# Altium schematic sheet 17.RK3588_HDMI_eDP Interface.SchDoc
size 420 x 297 mm; Revision: V2.1; Schematic Page Number: 11; Page Number: 17; Check: <Checker>; Schematic Name: RK_NVR_DEMO1_RK3588_LP4/4x_V21; Page Count: 43; Page name: 17.RK3588_HDMI/eDP Interface; Designer: Zhangdz; Schematic Page Count: 99; Revcode: V2.1; DsnPath: E:\Work\SBER\RK3588_SOM\temp\RK_NVR_DEMO1_RK3588_LP4XD200P232SD8_V21_20211228.DSN; SchematicName: RK_NVR_DEMO1_RK3588_LP4/4x_V21; PageName: 17.RK3588_HDMI/eDP Interface; PageSize: A3; TopSchematic: True
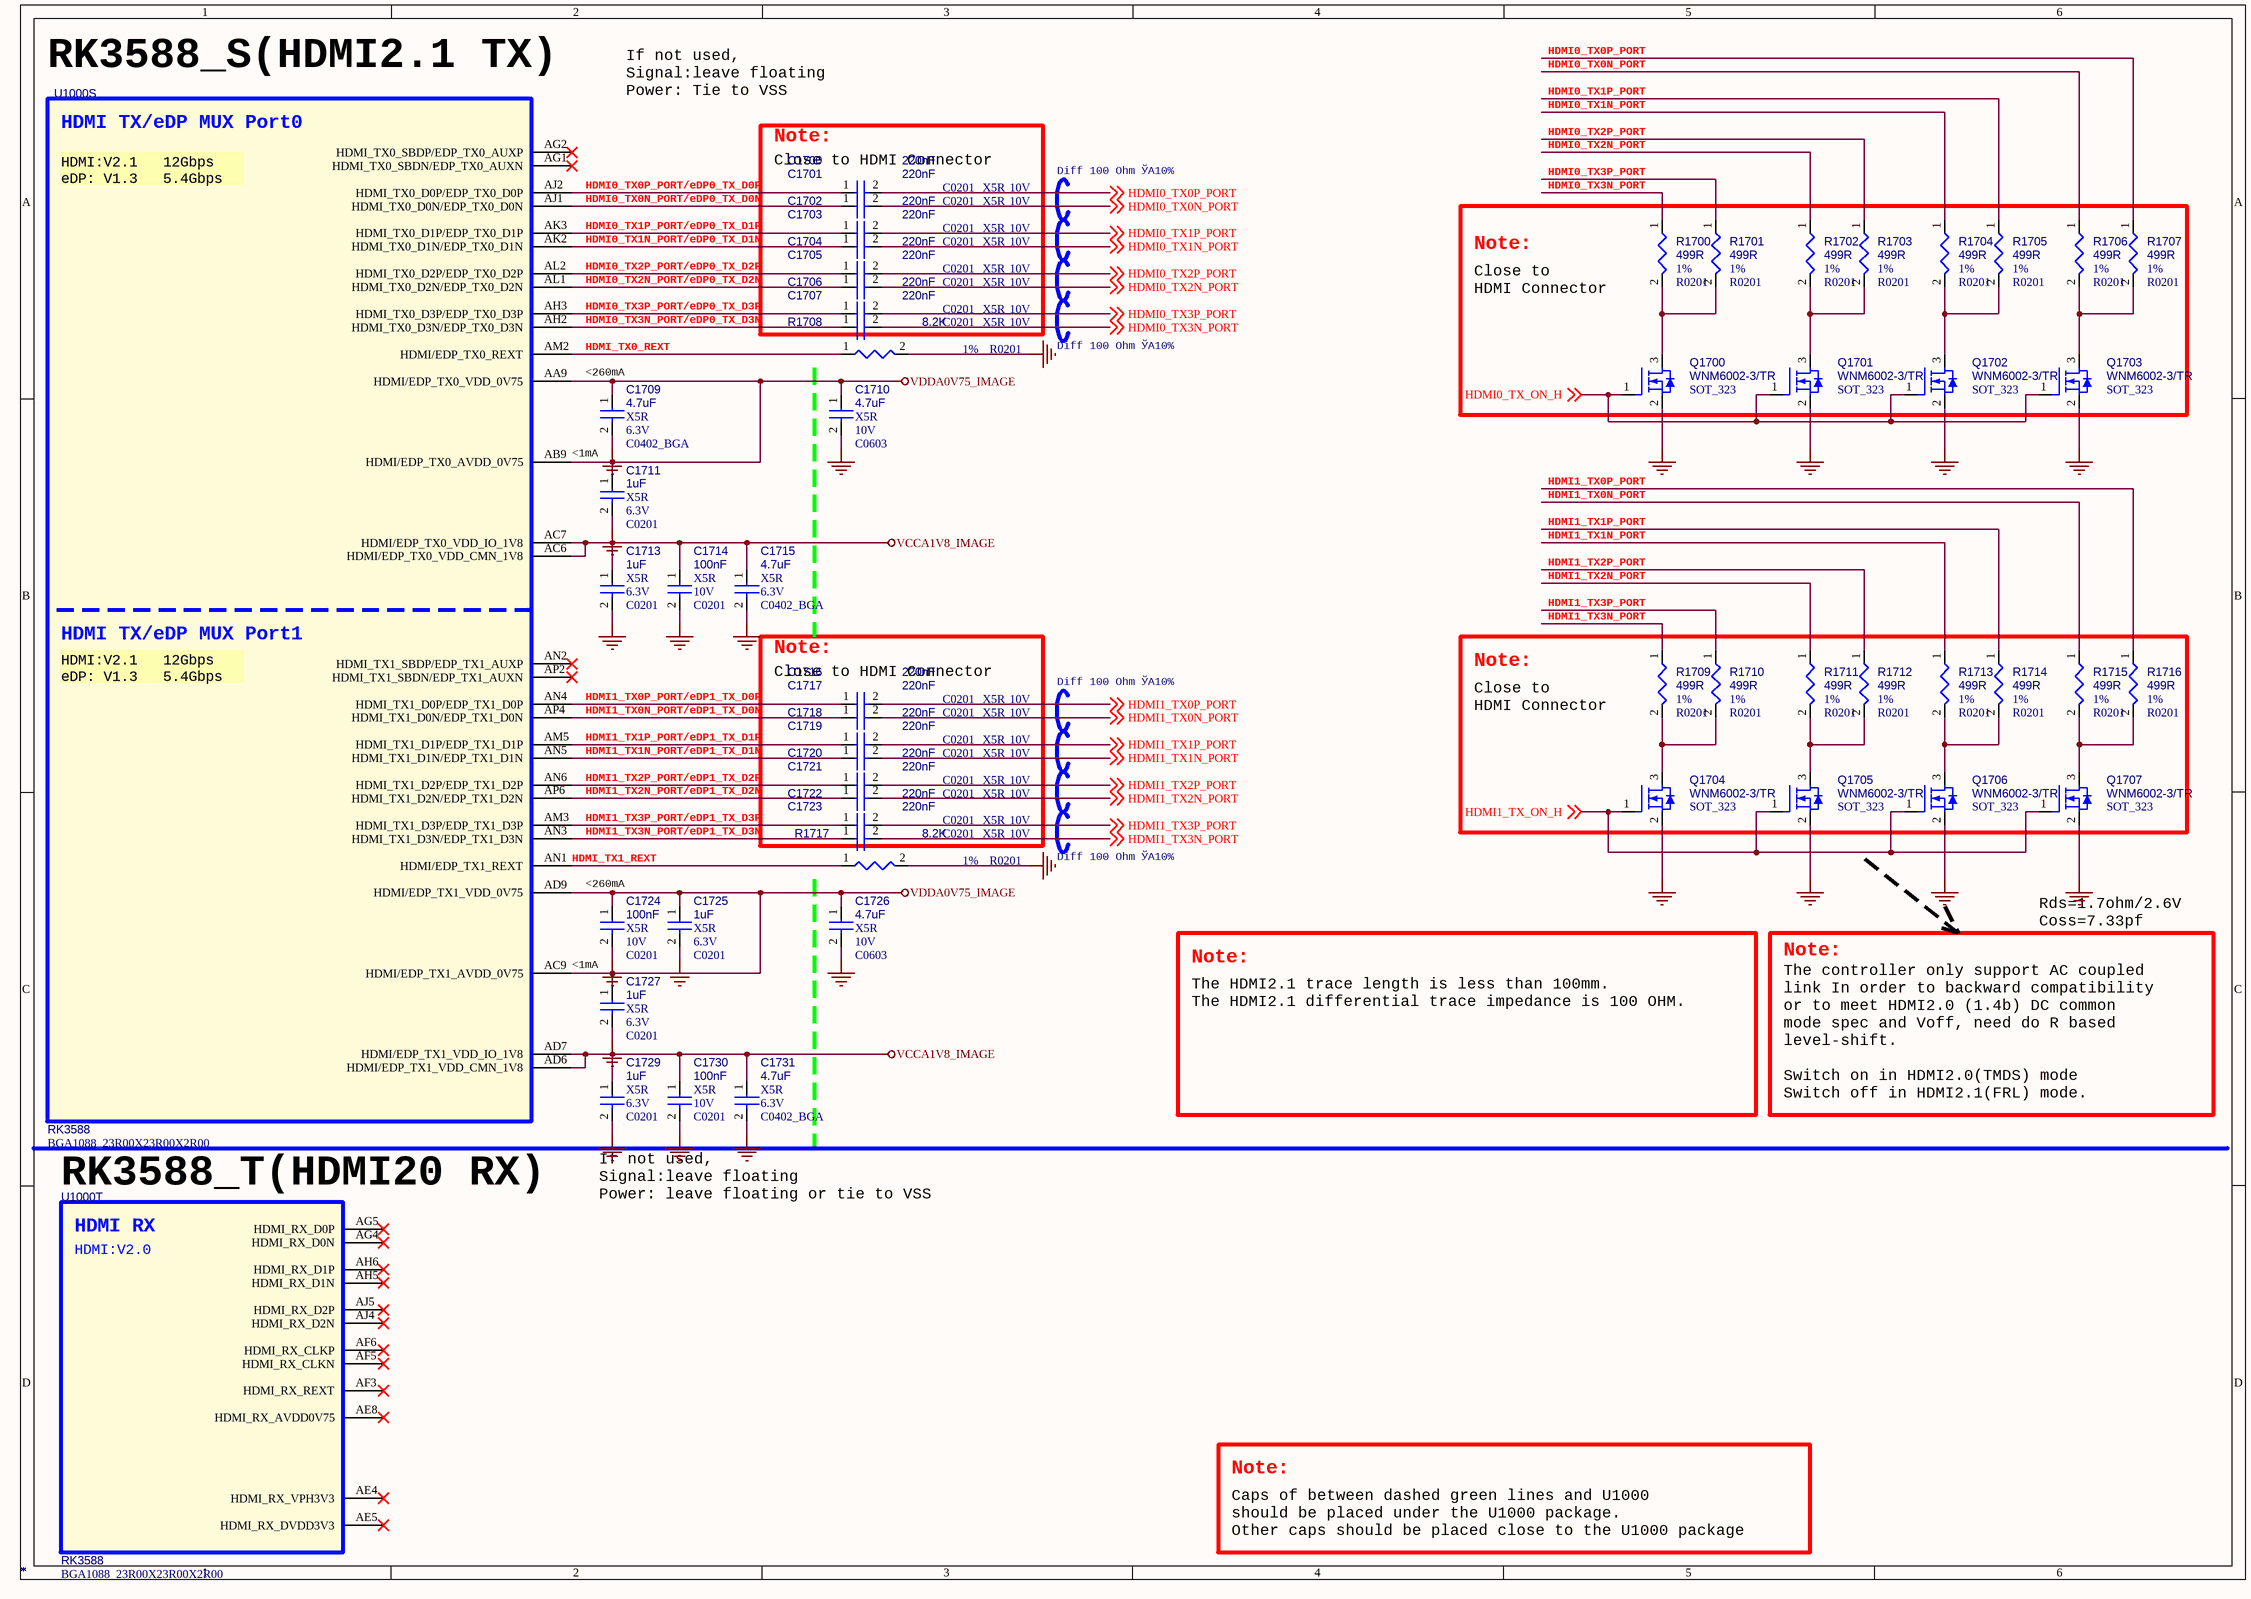
[diagram p0: 17.RK3588_HDMI_eDP Interface.SchDoc]

## Parts
C1700  *  Voltage: 10V  Dielectric: X5R  [C0201]
C1701  *  Voltage: 10V  Dielectric: X5R  [C0201]
C1702  *  Voltage: 10V  Dielectric: X5R  [C0201]
C1703  *  Voltage: 10V  Dielectric: X5R  [C0201]
C1704  *  Voltage: 10V  Dielectric: X5R  [C0201]
C1705  *  Voltage: 10V  Dielectric: X5R  [C0201]
C1706  *  Voltage: 10V  Dielectric: X5R  [C0201]
C1707  *  Voltage: 10V  Dielectric: X5R  [C0201]
C1709  *  Voltage: 6.3V  Dielectric: X5R  [C0402_BGA]
C1710  *  Voltage: 10V  Dielectric: X5R  [C0603]
C1711  *  Voltage: 6.3V  Dielectric: X5R  [C0201]
C1713  *  Voltage: 6.3V  Dielectric: X5R  [C0201]
C1714  *  Voltage: 10V  Dielectric: X5R  [C0201]
C1715  *  Voltage: 6.3V  Dielectric: X5R  [C0402_BGA]
C1716  *  Voltage: 10V  Dielectric: X5R  [C0201]
C1717  *  Voltage: 10V  Dielectric: X5R  [C0201]
C1718  *  Voltage: 10V  Dielectric: X5R  [C0201]
C1719  *  Voltage: 10V  Dielectric: X5R  [C0201]
C1720  *  Voltage: 10V  Dielectric: X5R  [C0201]
C1721  *  Voltage: 10V  Dielectric: X5R  [C0201]
C1722  *  Voltage: 10V  Dielectric: X5R  [C0201]
C1723  *  Voltage: 10V  Dielectric: X5R  [C0201]
C1724  *  Voltage: 10V  Dielectric: X5R  [C0201]
C1725  *  Voltage: 6.3V  Dielectric: X5R  [C0201]
C1726  *  Voltage: 10V  Dielectric: X5R  [C0603]
C1727  *  Voltage: 6.3V  Dielectric: X5R  [C0201]
C1729  *  Voltage: 6.3V  Dielectric: X5R  [C0201]
C1730  *  Voltage: 10V  Dielectric: X5R  [C0201]
C1731  *  Voltage: 6.3V  Dielectric: X5R  [C0402_BGA]
Q1700  *  PCB Footprint: SOT_323  [SOT23]
Q1701  *  PCB Footprint: SOT_323  [SOT23]
Q1702  *  PCB Footprint: SOT_323  [SOT23]
Q1703  *  PCB Footprint: SOT_323  [SOT23]
Q1704  *  PCB Footprint: SOT_323  [SOT23]
Q1705  *  PCB Footprint: SOT_323  [SOT23]
Q1706  *  PCB Footprint: SOT_323  [SOT23]
Q1707  *  PCB Footprint: SOT_323  [SOT23]
R1700  *  PCB Footprint: R0201  Tolerance: 1%  [R0402]
R1701  *  PCB Footprint: R0201  Tolerance: 1%  [R0402]
R1702  *  PCB Footprint: R0201  Tolerance: 1%  [R0402]
R1703  *  PCB Footprint: R0201  Tolerance: 1%  [R0402]
R1704  *  PCB Footprint: R0201  Tolerance: 1%  [R0402]
R1705  *  PCB Footprint: R0201  Tolerance: 1%  [R0402]
R1706  *  PCB Footprint: R0201  Tolerance: 1%  [R0402]
R1707  *  PCB Footprint: R0201  Tolerance: 1%  [R0402]
R1708  *  PCB Footprint: R0201  Tolerance: 1%  [R0402]
R1709  *  PCB Footprint: R0201  Tolerance: 1%  [R0402]
R1710  *  PCB Footprint: R0201  Tolerance: 1%  [R0402]
R1711  *  PCB Footprint: R0201  Tolerance: 1%  [R0402]
R1712  *  PCB Footprint: R0201  Tolerance: 1%  [R0402]
R1713  *  PCB Footprint: R0201  Tolerance: 1%  [R0402]
R1714  *  PCB Footprint: R0201  Tolerance: 1%  [R0402]
R1715  *  PCB Footprint: R0201  Tolerance: 1%  [R0402]
R1716  *  PCB Footprint: R0201  Tolerance: 1%  [R0402]
R1717  *  PCB Footprint: R0201  Tolerance: 1%  [R0402]
U1000  *  [BGA1088_23R00X23R00X2R00]  (parts S,T of 26)

## Blocks framed on the sheet
Note:: C1700-C1707
Note:: Q1700-Q1703 R1700-R1707
Note:: C1716-C1723
Note:: Q1704-Q1707 R1709-R1716

## Nets
GND: C1709.2 C1710.2 C1711.2 C1713.2 C1714.2 C1715.2 C1724.2 C1725.2 C1726.2 C1727.2 C1729.2 C1730.2 C1731.2 Q1700.2(SOURCE) Q1701.2(SOURCE) Q1702.2(SOURCE) Q1703.2(SOURCE) Q1704.2(SOURCE) Q1705.2(SOURCE) Q1706.2(SOURCE) Q1707.2(SOURCE) R1708.2 R1717.2
VCCA1V8_IMAGE: C1713.1 C1714.1 C1715.1 C1729.1 C1730.1 C1731.1 U1000.AC6(HDMI/EDP_TX0_VDD_CMN_1V8) U1000.AC7(HDMI/EDP_TX0_VDD_IO_1V8) U1000.AD6(HDMI/EDP_TX1_VDD_CMN_1V8) U1000.AD7(HDMI/EDP_TX1_VDD_IO_1V8)
VDDA0V75_IMAGE: C1709.1 C1710.1 C1711.1 C1724.1 C1725.1 C1726.1 C1727.1 U1000.AA9(HDMI/EDP_TX0_VDD_0V75) U1000.AB9(HDMI/EDP_TX0_AVDD_0V75) U1000.AC9(HDMI/EDP_TX1_AVDD_0V75) U1000.AD9(HDMI/EDP_TX1_VDD_0V75)
HDMI0_TX0N_PORT: C1701.2 R1706.1 ; off-sheet HDMI0_TX0N_PORT
HDMI0_TX0N_PORT/eDP0_TX_D0N: C1701.1 U1000.AJ1(HDMI_TX0_D0N/EDP_TX0_D0N)
HDMI0_TX0P_PORT: C1700.2 R1707.1 ; off-sheet HDMI0_TX0P_PORT
HDMI0_TX0P_PORT/eDP0_TX_D0P: C1700.1 U1000.AJ2(HDMI_TX0_D0P/EDP_TX0_D0P)
HDMI0_TX1N_PORT: C1703.2 R1704.1 ; off-sheet HDMI0_TX1N_PORT
HDMI0_TX1N_PORT/eDP0_TX_D1N: C1703.1 U1000.AK2(HDMI_TX0_D1N/EDP_TX0_D1N)
HDMI0_TX1P_PORT: C1702.2 R1705.1 ; off-sheet HDMI0_TX1P_PORT
HDMI0_TX1P_PORT/eDP0_TX_D1P: C1702.1 U1000.AK3(HDMI_TX0_D1P/EDP_TX0_D1P)
HDMI0_TX2N_PORT: C1705.2 R1702.1 ; off-sheet HDMI0_TX2N_PORT
HDMI0_TX2N_PORT/eDP0_TX_D2N: C1705.1 U1000.AL1(HDMI_TX0_D2N/EDP_TX0_D2N)
HDMI0_TX2P_PORT: C1704.2 R1703.1 ; off-sheet HDMI0_TX2P_PORT
HDMI0_TX2P_PORT/eDP0_TX_D2P: C1704.1 U1000.AL2(HDMI_TX0_D2P/EDP_TX0_D2P)
HDMI0_TX3N_PORT: C1707.2 R1700.1 ; off-sheet HDMI0_TX3N_PORT
HDMI0_TX3N_PORT/eDP0_TX_D3N: C1707.1 U1000.AH2(HDMI_TX0_D3N/EDP_TX0_D3N)
HDMI0_TX3P_PORT: C1706.2 R1701.1 ; off-sheet HDMI0_TX3P_PORT
HDMI0_TX3P_PORT/eDP0_TX_D3P: C1706.1 U1000.AH3(HDMI_TX0_D3P/EDP_TX0_D3P)
HDMI0_TX_ON_H: Q1700.1(GATE) Q1701.1(GATE) Q1702.1(GATE) Q1703.1(GATE) ; off-sheet HDMI0_TX_ON_H
HDMI1_TX0N_PORT: C1717.2 R1715.1 ; off-sheet HDMI1_TX0N_PORT
HDMI1_TX0N_PORT/eDP1_TX_D0N: C1717.1 U1000.AP4(HDMI_TX1_D0N/EDP_TX1_D0N)
HDMI1_TX0P_PORT: C1716.2 R1716.1 ; off-sheet HDMI1_TX0P_PORT
HDMI1_TX0P_PORT/eDP1_TX_D0P: C1716.1 U1000.AN4(HDMI_TX1_D0P/EDP_TX1_D0P)
HDMI1_TX1N_PORT: C1719.2 R1713.1 ; off-sheet HDMI1_TX1N_PORT
HDMI1_TX1N_PORT/eDP1_TX_D1N: C1719.1 U1000.AN5(HDMI_TX1_D1N/EDP_TX1_D1N)
HDMI1_TX1P_PORT: C1718.2 R1714.1 ; off-sheet HDMI1_TX1P_PORT
HDMI1_TX1P_PORT/eDP1_TX_D1P: C1718.1 U1000.AM5(HDMI_TX1_D1P/EDP_TX1_D1P)
HDMI1_TX2N_PORT: C1721.2 R1711.1 ; off-sheet HDMI1_TX2N_PORT
HDMI1_TX2N_PORT/eDP1_TX_D2N: C1721.1 U1000.AP6(HDMI_TX1_D2N/EDP_TX1_D2N)
HDMI1_TX2P_PORT: C1720.2 R1712.1 ; off-sheet HDMI1_TX2P_PORT
HDMI1_TX2P_PORT/eDP1_TX_D2P: C1720.1 U1000.AN6(HDMI_TX1_D2P/EDP_TX1_D2P)
HDMI1_TX3N_PORT: C1723.2 R1709.1 ; off-sheet HDMI1_TX3N_PORT
HDMI1_TX3N_PORT/eDP1_TX_D3N: C1723.1 U1000.AN3(HDMI_TX1_D3N/EDP_TX1_D3N)
HDMI1_TX3P_PORT: C1722.2 R1710.1 ; off-sheet HDMI1_TX3P_PORT
HDMI1_TX3P_PORT/eDP1_TX_D3P: C1722.1 U1000.AM3(HDMI_TX1_D3P/EDP_TX1_D3P)
HDMI1_TX_ON_H: Q1704.1(GATE) Q1705.1(GATE) Q1706.1(GATE) Q1707.1(GATE) ; off-sheet HDMI1_TX_ON_H
HDMI_TX0_REXT: R1708.1 U1000.AM2(HDMI/EDP_TX0_REXT)
HDMI_TX1_REXT: R1717.1 U1000.AN1(HDMI/EDP_TX1_REXT)
NetQ1700_3: Q1700.3(DRAIN) R1700.2 R1701.2
NetQ1701_3: Q1701.3(DRAIN) R1702.2 R1703.2
NetQ1702_3: Q1702.3(DRAIN) R1704.2 R1705.2
NetQ1703_3: Q1703.3(DRAIN) R1706.2 R1707.2
NetQ1704_3: Q1704.3(DRAIN) R1709.2 R1710.2
NetQ1705_3: Q1705.3(DRAIN) R1711.2 R1712.2
NetQ1706_3: Q1706.3(DRAIN) R1713.2 R1714.2
NetQ1707_3: Q1707.3(DRAIN) R1715.2 R1716.2

Not connected (* = marked no-connect by the designer): U1000 AE4(HDMI_RX_VPH3V3)* AE5(HDMI_RX_DVDD3V3)* AE8(HDMI_RX_AVDD0V75)* AF3(HDMI_RX_REXT)* AF5(HDMI_RX_CLKN)* AF6(HDMI_RX_CLKP)* AG1(HDMI_TX0_SBDN/EDP_TX0_AUXN)* AG2(HDMI_TX0_SBDP/EDP_TX0_AUXP)* AG4(HDMI_RX_D0N)* AG5(HDMI_RX_D0P)* AH5(HDMI_RX_D1N)* AH6(HDMI_RX_D1P)* AJ4(HDMI_RX_D2N)* AJ5(HDMI_RX_D2P)* AN2(HDMI_TX1_SBDP/EDP_TX1_AUXP)* AP2(HDMI_TX1_SBDN/EDP_TX1_AUXN)*

## Notes on the sheet
- RK3588_S(HDMI2.1 TX)
- If not used,
  Signal:leave floating
  Power: Tie to VSS
- Close to HDMI Connector
- Diff 100 Ohm ЎА10%
- (near R1700) Close to
  HDMI Connector
- (near C1709) <260mA
- <1mA
- (near R1709) Close to
  HDMI Connector
- (near C1724) <260mA
- Rds=1.7ohm/2.6V
  Coss=7.33pf
- Note:
- The HDMI2.1 trace length is less than 100mm.
  The HDMI2.1 differential trace impedance is 100 OHM.
- The controller only support AC coupled
  link In order to backward compatibility
  or to meet HDMI2.0 (1.4b) DC common
  mode spec and Voff, need do R based
  level-shift.
  Switch on in HDMI2.0(TMDS) mode
  Switch off in HDMI2.1(FRL) mode.
- (near U1000) RK3588_T(HDMI20 RX)
- If not used,
  Signal:leave floating
  Power: leave floating or tie to VSS
- Caps of between dashed green lines and U1000
  should be placed under the U1000 package.
  Other caps should be placed close to the U1000 package
- (in symbol SOC_RK3588, part S) HDMI TX/eDP MUX Port0; HDMI:V2.1   12Gbps / eDP: V1.3   5.4Gbps; HDMI TX/eDP MUX Port1
- (in symbol SOC_RK3588, part T) HDMI RX; HDMI:V2.0

## Library data of the parts
C1700 = CAP NP: cap,220.00nF,+/-10%,10V,X5R,C0201; Part Reference: C1700; Manufacturer: TDK; Value: 220nF; RK PN: C0603X5R1A224K030BB; Priority: A; Tolerance: 10%; PCB Footprint: C0201; Part Type: C0201; Manufacturer PN: C0603X5R1A224K030BB; Created by: JJJ
C1701 = CAP NP: cap,220.00nF,+/-10%,10V,X5R,C0201; Part Reference: C1701; Manufacturer PN: C0603X5R1A224K030BB; Manufacturer: TDK; Value: 220nF; Tolerance: 10%; Priority: A; PCB Footprint: C0201; Created by: JJJ; Part Type: C0201; RK PN: C0603X5R1A224K030BB
C1702 = CAP NP: cap,220.00nF,+/-10%,10V,X5R,C0201; Part Reference: C1702; Manufacturer: TDK; Value: 220nF; RK PN: C0603X5R1A224K030BB; Priority: A; Tolerance: 10%; PCB Footprint: C0201; Part Type: C0201; Manufacturer PN: C0603X5R1A224K030BB; Created by: JJJ
C1703 = CAP NP: cap,220.00nF,+/-10%,10V,X5R,C0201; Part Reference: C1703; Manufacturer PN: C0603X5R1A224K030BB; Manufacturer: TDK; Value: 220nF; Tolerance: 10%; Priority: A; PCB Footprint: C0201; Created by: JJJ; Part Type: C0201; RK PN: C0603X5R1A224K030BB
C1704 = CAP NP: cap,220.00nF,+/-10%,10V,X5R,C0201; Part Reference: C1704; Manufacturer: TDK; Value: 220nF; RK PN: C0603X5R1A224K030BB; Priority: A; Tolerance: 10%; PCB Footprint: C0201; Part Type: C0201; Manufacturer PN: C0603X5R1A224K030BB; Created by: JJJ
C1705 = CAP NP: cap,220.00nF,+/-10%,10V,X5R,C0201; Part Reference: C1705; Manufacturer PN: C0603X5R1A224K030BB; Manufacturer: TDK; Value: 220nF; Tolerance: 10%; Priority: A; PCB Footprint: C0201; Created by: JJJ; Part Type: C0201; RK PN: C0603X5R1A224K030BB
C1706 = CAP NP: cap,220.00nF,+/-10%,10V,X5R,C0201; Part Reference: C1706; Manufacturer: TDK; Value: 220nF; RK PN: C0603X5R1A224K030BB; Priority: A; Tolerance: 10%; PCB Footprint: C0201; Part Type: C0201; Manufacturer PN: C0603X5R1A224K030BB; Created by: JJJ
C1707 = CAP NP: cap,220.00nF,+/-10%,10V,X5R,C0201; Part Reference: C1707; Manufacturer: TDK; Value: 220nF; RK PN: C0603X5R1A224K030BB; Priority: A; Tolerance: 10%; PCB Footprint: C0201; Part Type: C0201; Manufacturer PN: C0603X5R1A224K030BB; Created by: JJJ
C1709 = CAP NP: cap,4.70uF,+/-10%,6.3V,X5R,C0402; Part Reference: C1709; Manufacturer PN: C1005X5R0J475K050BC; Manufacturer: TDK; Value: 4.7uF; Tolerance: 10%; Priority: A; PCB Footprint: C0402_BGA; Created by: JJJ; Part Type: C0402; RK PN: C1005X5R0J475K050BC
C1710 = CAP NP: cap,4.70uF,+/-10%,10V,X5R,C0603; Part Reference: C1710; Manufacturer PN: C1608X5R1A475K080AC; Manufacturer: TDK; Value: 4.7uF; Tolerance: 10%; Priority: A; PCB Footprint: C0603; Created by: JJJ; Part Type: C0603; RK PN: C1608X5R1A475K080AC
C1711 = CAP NP: cap,1.00uF,+/-20%,6.3V,X5R,C0201; Part Reference: C1711; Manufacturer PN: C0603X5R0J105M030BC; Manufacturer: TDK; Value: 1uF; Tolerance: 20%; Priority: A; PCB Footprint: C0201; Created by: JJJ; Part Type: C0201; RK PN: C0603X5R0J105M030BC
C1713 = CAP NP: cap,1.00uF,+/-20%,6.3V,X5R,C0201; Part Reference: C1713; Manufacturer: TDK; Value: 1uF; RK PN: C0603X5R0J105M030BC; Priority: A; Tolerance: 20%; PCB Footprint: C0201; Part Type: C0201; Manufacturer PN: C0603X5R0J105M030BC; Created by: JJJ
C1714 = CAP NP: cap,100.00nF,+/-10%,10V,X5R,C0201; Part Reference: C1714; Manufacturer PN: C0603X5R1A104K030BC; Manufacturer: TDK; Value: 100nF; Tolerance: 10%; Priority: A; PCB Footprint: C0201; Created by: JJJ; Part Type: C0201; RK PN: C0603X5R1A104K030BC
C1715 = CAP NP: cap,4.70uF,+/-10%,6.3V,X5R,C0402; Part Reference: C1715; Manufacturer: TDK; Value: 4.7uF; RK PN: C1005X5R0J475K050BC; Priority: A; Tolerance: 10%; PCB Footprint: C0402_BGA; Part Type: C0402; Manufacturer PN: C1005X5R0J475K050BC; Created by: JJJ
C1716 = CAP NP: cap,220.00nF,+/-10%,10V,X5R,C0201; Part Reference: C1716; Manufacturer: TDK; Value: 220nF; RK PN: C0603X5R1A224K030BB; Priority: A; Tolerance: 10%; PCB Footprint: C0201; Part Type: C0201; Manufacturer PN: C0603X5R1A224K030BB; Created by: JJJ
C1717 = CAP NP: cap,220.00nF,+/-10%,10V,X5R,C0201; Part Reference: C1717; Manufacturer PN: C0603X5R1A224K030BB; Manufacturer: TDK; Value: 220nF; Tolerance: 10%; Priority: A; PCB Footprint: C0201; Created by: JJJ; Part Type: C0201; RK PN: C0603X5R1A224K030BB
C1718 = CAP NP: cap,220.00nF,+/-10%,10V,X5R,C0201; Part Reference: C1718; Manufacturer: TDK; Value: 220nF; RK PN: C0603X5R1A224K030BB; Priority: A; Tolerance: 10%; PCB Footprint: C0201; Part Type: C0201; Manufacturer PN: C0603X5R1A224K030BB; Created by: JJJ
C1719 = CAP NP: cap,220.00nF,+/-10%,10V,X5R,C0201; Part Reference: C1719; Manufacturer PN: C0603X5R1A224K030BB; Manufacturer: TDK; Value: 220nF; Tolerance: 10%; Priority: A; PCB Footprint: C0201; Created by: JJJ; Part Type: C0201; RK PN: C0603X5R1A224K030BB
C1720 = CAP NP: cap,220.00nF,+/-10%,10V,X5R,C0201; Part Reference: C1720; Manufacturer: TDK; Value: 220nF; RK PN: C0603X5R1A224K030BB; Priority: A; Tolerance: 10%; PCB Footprint: C0201; Part Type: C0201; Manufacturer PN: C0603X5R1A224K030BB; Created by: JJJ
C1721 = CAP NP: cap,220.00nF,+/-10%,10V,X5R,C0201; Part Reference: C1721; Manufacturer PN: C0603X5R1A224K030BB; Manufacturer: TDK; Value: 220nF; Tolerance: 10%; Priority: A; PCB Footprint: C0201; Created by: JJJ; Part Type: C0201; RK PN: C0603X5R1A224K030BB
C1722 = CAP NP: cap,220.00nF,+/-10%,10V,X5R,C0201; Part Reference: C1722; Manufacturer: TDK; Value: 220nF; RK PN: C0603X5R1A224K030BB; Priority: A; Tolerance: 10%; PCB Footprint: C0201; Part Type: C0201; Manufacturer PN: C0603X5R1A224K030BB; Created by: JJJ
C1723 = CAP NP: cap,220.00nF,+/-10%,10V,X5R,C0201; Part Reference: C1723; Manufacturer: TDK; Value: 220nF; RK PN: C0603X5R1A224K030BB; Priority: A; Tolerance: 10%; PCB Footprint: C0201; Part Type: C0201; Manufacturer PN: C0603X5R1A224K030BB; Created by: JJJ
C1724 = CAP NP: cap,100.00nF,+/-10%,10V,X5R,C0201; Part Reference: C1724; Manufacturer PN: C0603X5R1A104K030BC; Manufacturer: TDK; Value: 100nF; Tolerance: 10%; Priority: A; PCB Footprint: C0201; Created by: JJJ; Part Type: C0201; RK PN: C0603X5R1A104K030BC
C1725 = CAP NP: cap,1.00uF,+/-20%,6.3V,X5R,C0201; Part Reference: C1725; Manufacturer: TDK; Value: 1uF; RK PN: C0603X5R0J105M030BC; Priority: A; Tolerance: 20%; PCB Footprint: C0201; Part Type: C0201; Manufacturer PN: C0603X5R0J105M030BC; Created by: JJJ
C1726 = CAP NP: cap,4.70uF,+/-10%,10V,X5R,C0603; Part Reference: C1726; Manufacturer: TDK; Value: 4.7uF; RK PN: C1608X5R1A475K080AC; Priority: A; Tolerance: 10%; PCB Footprint: C0603; Part Type: C0603; Manufacturer PN: C1608X5R1A475K080AC; Created by: JJJ
C1727 = CAP NP: cap,1.00uF,+/-20%,6.3V,X5R,C0201; Part Reference: C1727; Manufacturer PN: C0603X5R0J105M030BC; Manufacturer: TDK; Value: 1uF; Tolerance: 20%; Priority: A; PCB Footprint: C0201; Created by: JJJ; Part Type: C0201; RK PN: C0603X5R0J105M030BC
C1729 = CAP NP: cap,1.00uF,+/-20%,6.3V,X5R,C0201; Part Reference: C1729; Manufacturer: TDK; Value: 1uF; RK PN: C0603X5R0J105M030BC; Priority: A; Tolerance: 20%; PCB Footprint: C0201; Part Type: C0201; Manufacturer PN: C0603X5R0J105M030BC; Created by: JJJ
C1730 = CAP NP: cap,100.00nF,+/-10%,10V,X5R,C0201; Part Reference: C1730; Manufacturer PN: C0603X5R1A104K030BC; Manufacturer: TDK; Value: 100nF; Tolerance: 10%; Priority: A; PCB Footprint: C0201; Created by: JJJ; Part Type: C0201; RK PN: C0603X5R1A104K030BC
C1731 = CAP NP: cap,4.70uF,+/-10%,6.3V,X5R,C0402; Part Reference: C1731; Manufacturer: TDK; Value: 4.7uF; RK PN: C1005X5R0J475K050BC; Priority: A; Tolerance: 10%; PCB Footprint: C0402_BGA; Part Type: C0402; Manufacturer PN: C1005X5R0J475K050BC; Created by: JJJ
Q1700 = MOSFET N: NMOS,WNM6002-3/TR,SOT_323,Id=0.3A,Vds=60V; Part Reference: Q1700; Manufacturer: WillSemi(О¤¶ы°лµјМе); Pd: 0.23W; Vgsth: 1.3V; VDS: 60V; Vgs: ЎА20V; Id_max: 0.3A; Priority: A; Value: WNM6002-3/TR; Created by: JJJ; Manufacturer PN: WNM6002-3/TR; Part Type: NMOS; RK PN: WNM6002-3/TR
Q1701 = MOSFET N: NMOS,WNM6002-3/TR,SOT_323,Id=0.3A,Vds=60V; Part Reference: Q1701; Manufacturer: WillSemi(О¤¶ы°лµјМе); Pd: 0.23W; Vgsth: 1.3V; VDS: 60V; Vgs: ЎА20V; Id_max: 0.3A; Priority: A; Value: WNM6002-3/TR; Created by: JJJ; Manufacturer PN: WNM6002-3/TR; Part Type: NMOS; RK PN: WNM6002-3/TR
Q1702 = MOSFET N: NMOS,WNM6002-3/TR,SOT_323,Id=0.3A,Vds=60V; Part Reference: Q1702; Manufacturer: WillSemi(О¤¶ы°лµјМе); Pd: 0.23W; Vgsth: 1.3V; VDS: 60V; Vgs: ЎА20V; Id_max: 0.3A; Priority: A; Value: WNM6002-3/TR; Created by: JJJ; Manufacturer PN: WNM6002-3/TR; Part Type: NMOS; RK PN: WNM6002-3/TR
Q1703 = MOSFET N: NMOS,WNM6002-3/TR,SOT_323,Id=0.3A,Vds=60V; Part Reference: Q1703; Manufacturer: WillSemi(О¤¶ы°лµјМе); Priority: A; Id_max: 0.3A; Vgs: ЎА20V; VDS: 60V; Vgsth: 1.3V; Pd: 0.23W; Value: WNM6002-3/TR; RK PN: WNM6002-3/TR; Part Type: NMOS; Manufacturer PN: WNM6002-3/TR; Created by: JJJ
Q1704 = MOSFET N: NMOS,WNM6002-3/TR,SOT_323,Id=0.3A,Vds=60V; Part Reference: Q1704; Manufacturer: WillSemi(О¤¶ы°лµјМе); Priority: A; Id_max: 0.3A; Vgs: ЎА20V; VDS: 60V; Vgsth: 1.3V; Pd: 0.23W; Value: WNM6002-3/TR; RK PN: WNM6002-3/TR; Part Type: NMOS; Manufacturer PN: WNM6002-3/TR; Created by: JJJ
Q1705 = MOSFET N: NMOS,WNM6002-3/TR,SOT_323,Id=0.3A,Vds=60V; Part Reference: Q1705; Manufacturer: WillSemi(О¤¶ы°лµјМе); Priority: A; Id_max: 0.3A; Vgs: ЎА20V; VDS: 60V; Vgsth: 1.3V; Pd: 0.23W; Value: WNM6002-3/TR; RK PN: WNM6002-3/TR; Part Type: NMOS; Manufacturer PN: WNM6002-3/TR; Created by: JJJ
Q1706 = MOSFET N: NMOS,WNM6002-3/TR,SOT_323,Id=0.3A,Vds=60V; Part Reference: Q1706; Manufacturer: WillSemi(О¤¶ы°лµјМе); Priority: A; Id_max: 0.3A; Vgs: ЎА20V; VDS: 60V; Vgsth: 1.3V; Pd: 0.23W; Value: WNM6002-3/TR; RK PN: WNM6002-3/TR; Part Type: NMOS; Manufacturer PN: WNM6002-3/TR; Created by: JJJ
Q1707 = MOSFET N: NMOS,WNM6002-3/TR,SOT_323,Id=0.3A,Vds=60V; Part Reference: Q1707; Manufacturer: WillSemi(О¤¶ы°лµјМе); Pd: 0.23W; Vgsth: 1.3V; VDS: 60V; Vgs: ЎА20V; Id_max: 0.3A; Priority: A; Value: WNM6002-3/TR; Created by: JJJ; Manufacturer PN: WNM6002-3/TR; Part Type: NMOS; RK PN: WNM6002-3/TR
R1700 = RESISTOR_Dup1: НЁУГєсД¤µзЧи,499R,+/-1%,R0201,1/20W.; Part Reference: R1700; Manufacturer PN: RC0201FR-07499RL; Manufacturer: YAGEO; Wattage: 1/20W; Priority: A; Value: 499R; Created by: YTL; Part Type: НЁУГєсД¤µзЧи; RK PN: RC0201FR-07499RL
R1701 = RESISTOR_Dup1: НЁУГєсД¤µзЧи,499R,+/-1%,R0201,1/20W.; Part Reference: R1701; Manufacturer: YAGEO; RK PN: RC0201FR-07499RL; Priority: A; Wattage: 1/20W; Value: 499R; Part Type: НЁУГєсД¤µзЧи; Manufacturer PN: RC0201FR-07499RL; Created by: YTL
R1702 = RESISTOR_Dup1: НЁУГєсД¤µзЧи,499R,+/-1%,R0201,1/20W.; Part Reference: R1702; Manufacturer: YAGEO; RK PN: RC0201FR-07499RL; Priority: A; Wattage: 1/20W; Value: 499R; Part Type: НЁУГєсД¤µзЧи; Manufacturer PN: RC0201FR-07499RL; Created by: YTL
R1703 = RESISTOR_Dup1: НЁУГєсД¤µзЧи,499R,+/-1%,R0201,1/20W.; Part Reference: R1703; Manufacturer: YAGEO; RK PN: RC0201FR-07499RL; Priority: A; Wattage: 1/20W; Value: 499R; Part Type: НЁУГєсД¤µзЧи; Manufacturer PN: RC0201FR-07499RL; Created by: YTL
R1704 = RESISTOR_Dup1: НЁУГєсД¤µзЧи,499R,+/-1%,R0201,1/20W.; Part Reference: R1704; Manufacturer PN: RC0201FR-07499RL; Manufacturer: YAGEO; Wattage: 1/20W; Priority: A; Value: 499R; Created by: YTL; Part Type: НЁУГєсД¤µзЧи; RK PN: RC0201FR-07499RL
R1705 = RESISTOR_Dup1: НЁУГєсД¤µзЧи,499R,+/-1%,R0201,1/20W.; Part Reference: R1705; Manufacturer PN: RC0201FR-07499RL; Manufacturer: YAGEO; Wattage: 1/20W; Priority: A; Value: 499R; Created by: YTL; Part Type: НЁУГєсД¤µзЧи; RK PN: RC0201FR-07499RL
R1706 = RESISTOR_Dup1: НЁУГєсД¤µзЧи,499R,+/-1%,R0201,1/20W.; Part Reference: R1706; Manufacturer PN: RC0201FR-07499RL; Manufacturer: YAGEO; Wattage: 1/20W; Priority: A; Value: 499R; Created by: YTL; Part Type: НЁУГєсД¤µзЧи; RK PN: RC0201FR-07499RL
R1707 = RESISTOR_Dup1: НЁУГєсД¤µзЧи,499R,+/-1%,R0201,1/20W.; Part Reference: R1707; Manufacturer: YAGEO; RK PN: RC0201FR-07499RL; Priority: A; Wattage: 1/20W; Value: 499R; Part Type: НЁУГєсД¤µзЧи; Manufacturer PN: RC0201FR-07499RL; Created by: YTL
R1708 = RESISTOR_Dup1: НЁУГєсД¤µзЧи,8K2,+/-1%,R0201,1/20W.; Part Reference: R1708; Manufacturer PN: RC0201FR-078K2L; Manufacturer: YAGEO; Value: 8.2K; Wattage: 1/20W; Priority: A; Created by: YTL; Part Type: НЁУГєсД¤µзЧи; RK PN: RC0201FR-078K2L
R1709 = RESISTOR_Dup1: НЁУГєсД¤µзЧи,499R,+/-1%,R0201,1/20W.; Part Reference: R1709; Manufacturer PN: RC0201FR-07499RL; Manufacturer: YAGEO; Wattage: 1/20W; Priority: A; Value: 499R; Created by: YTL; Part Type: НЁУГєсД¤µзЧи; RK PN: RC0201FR-07499RL
R1710 = RESISTOR_Dup1: НЁУГєсД¤µзЧи,499R,+/-1%,R0201,1/20W.; Part Reference: R1710; Manufacturer: YAGEO; RK PN: RC0201FR-07499RL; Priority: A; Wattage: 1/20W; Value: 499R; Part Type: НЁУГєсД¤µзЧи; Manufacturer PN: RC0201FR-07499RL; Created by: YTL
R1711 = RESISTOR_Dup1: НЁУГєсД¤µзЧи,499R,+/-1%,R0201,1/20W.; Part Reference: R1711; Manufacturer: YAGEO; RK PN: RC0201FR-07499RL; Priority: A; Wattage: 1/20W; Value: 499R; Part Type: НЁУГєсД¤µзЧи; Manufacturer PN: RC0201FR-07499RL; Created by: YTL
R1712 = RESISTOR_Dup1: НЁУГєсД¤µзЧи,499R,+/-1%,R0201,1/20W.; Part Reference: R1712; Manufacturer: YAGEO; RK PN: RC0201FR-07499RL; Priority: A; Wattage: 1/20W; Value: 499R; Part Type: НЁУГєсД¤µзЧи; Manufacturer PN: RC0201FR-07499RL; Created by: YTL
R1713 = RESISTOR_Dup1: НЁУГєсД¤µзЧи,499R,+/-1%,R0201,1/20W.; Part Reference: R1713; Manufacturer PN: RC0201FR-07499RL; Manufacturer: YAGEO; Wattage: 1/20W; Priority: A; Value: 499R; Created by: YTL; Part Type: НЁУГєсД¤µзЧи; RK PN: RC0201FR-07499RL
R1714 = RESISTOR_Dup1: НЁУГєсД¤µзЧи,499R,+/-1%,R0201,1/20W.; Part Reference: R1714; Manufacturer PN: RC0201FR-07499RL; Manufacturer: YAGEO; Wattage: 1/20W; Priority: A; Value: 499R; Created by: YTL; Part Type: НЁУГєсД¤µзЧи; RK PN: RC0201FR-07499RL
R1715 = RESISTOR_Dup1: НЁУГєсД¤µзЧи,499R,+/-1%,R0201,1/20W.; Part Reference: R1715; Manufacturer PN: RC0201FR-07499RL; Manufacturer: YAGEO; Wattage: 1/20W; Priority: A; Value: 499R; Created by: YTL; Part Type: НЁУГєсД¤µзЧи; RK PN: RC0201FR-07499RL
R1716 = RESISTOR_Dup1: НЁУГєсД¤µзЧи,499R,+/-1%,R0201,1/20W.; Part Reference: R1716; Manufacturer: YAGEO; RK PN: RC0201FR-07499RL; Priority: A; Wattage: 1/20W; Value: 499R; Part Type: НЁУГєсД¤µзЧи; Manufacturer PN: RC0201FR-07499RL; Created by: YTL
R1717 = RESISTOR_Dup1: НЁУГєсД¤µзЧи,8K2,+/-1%,R0201,1/20W.; Part Reference: R1717; Manufacturer PN: RC0201FR-078K2L; Manufacturer: YAGEO; Value: 8.2K; Wattage: 1/20W; Priority: A; Created by: YTL; Part Type: НЁУГєсД¤µзЧи; RK PN: RC0201FR-078K2L
U1000 = SOC_RK3588: ROCKCHIP SOC; Part Reference: U1000; Manufacturer: Rockchip (ИрРѕОў); SPLIT_INST: TRUE; SWAP_INFO: (S1+S2+S3+S4+S5+S6+S7+S8+S9+S10+S11+S12+S13+S14+S15+S16+S17+S18+S19+S20+S21+S22+S23+S24+S25+S26); Value: RK3588; Priority: A; RK PN: RK3588; Part Type: SOC; Manufacturer PN: RK3588; Created by: YWQ; PCB Footprint: BGA1088_23R00X23R00X2R00